# EAGLE schematic Spine14_v0 (EAGLE 6.4)

## Sheet 1 of 7
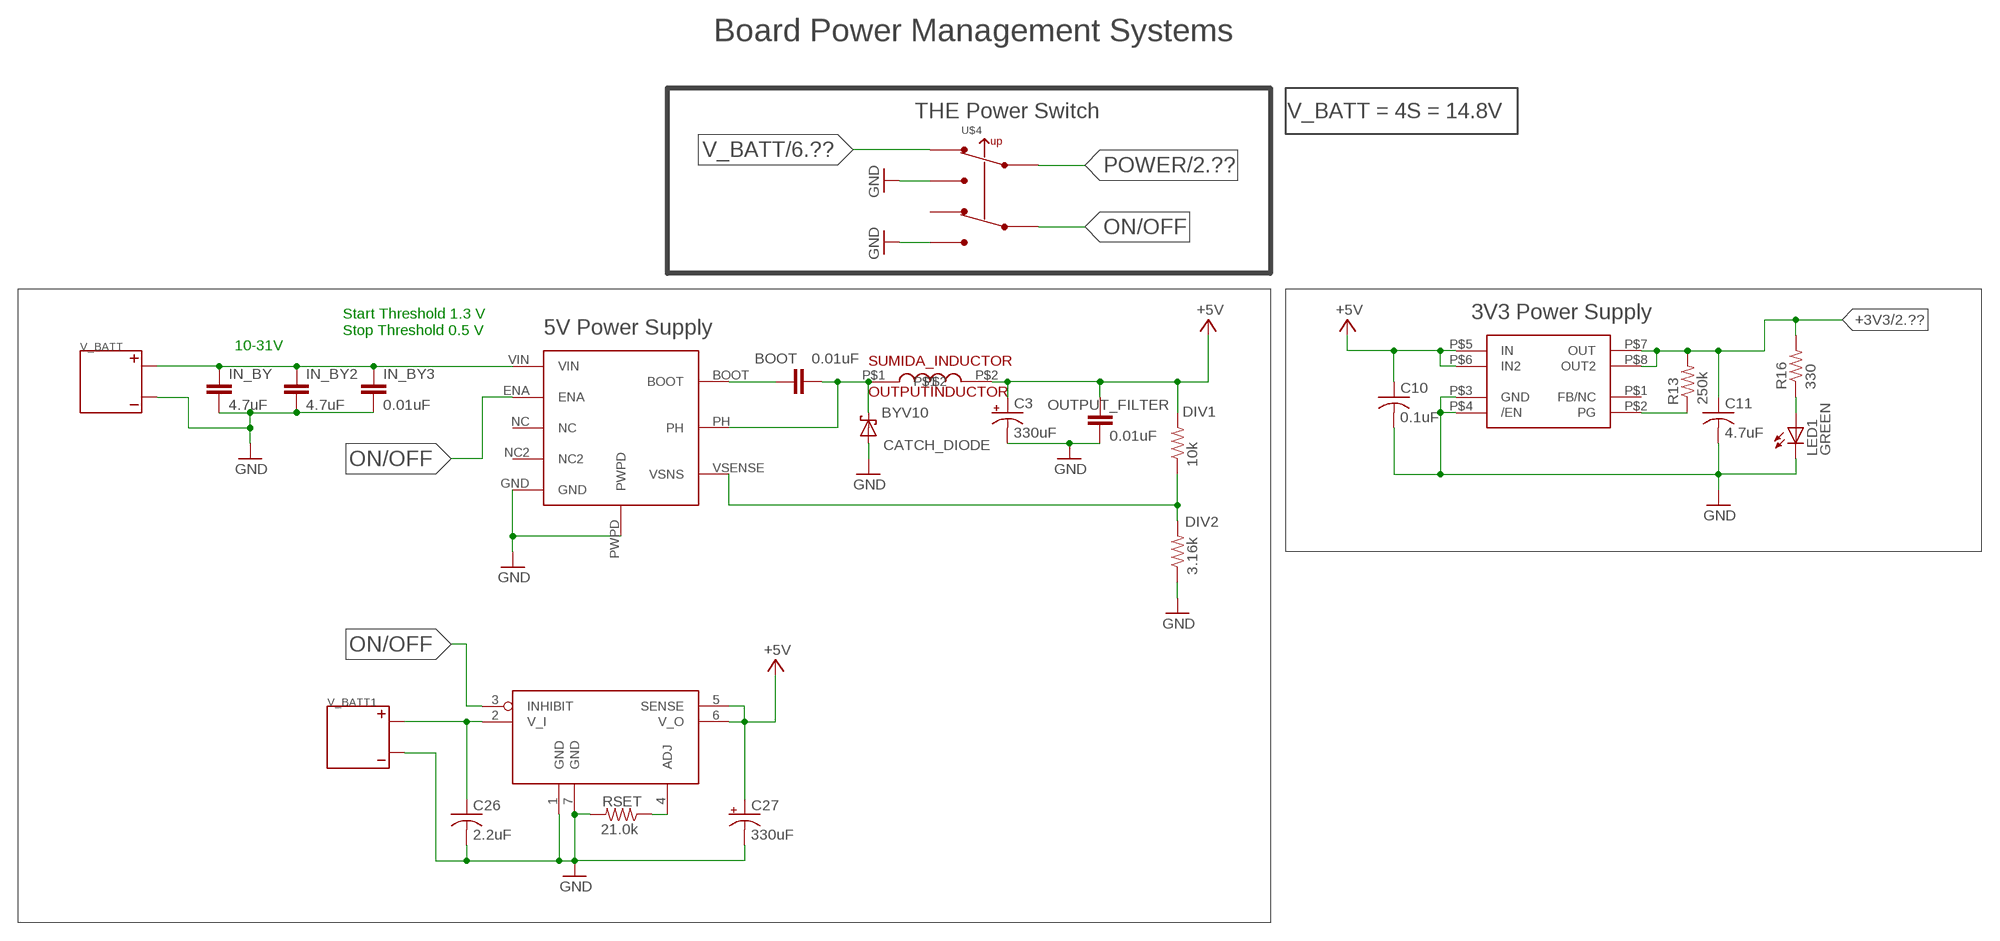
[diagram p0: schematic, sheet 1]

### Parts
BOOT  0.01uF  C-EUC0805  [C0805]
C3  330uF  CPOL-USF  [PANASONIC_F]
C10  0.1uF  C-USC0603  [C0603]
C11  4.7uF  C-USC0805  [C0805]
C26  2.2uF  C-USC0805  [C0805]
C27  330uF  CPOL-USF  [PANASONIC_F]
CATCH_DIODE  BYV10  [DO41-10]
DIV1  10k  R-US_R0805  [R0805]
DIV2  3.16k  R-US_R0805  [R0805]
IN_BY  4.7uF  C-EUC0805  [C0805]
IN_BY2  4.7uF  C-EUC0805  [C0805]
IN_BY3  0.01uF  C-EUC0805  [C0805]
LED1  GREEN  JON_LIB_LEDCHIPLED_0603  [JON_LIB_CHIPLED_0603]
OUTPUT_FILTER  0.01uF  C-EUC0805  [C0805]
OUTPUTINDUCTOR  SUMIDA_INDUCTOR  [SUMIDA_INDUCTOR]
R13  250k  R-US_R0603  [R0603]
R16  330  R-US_R0603  [R0603]
RSET  21.0k  R-US_R0805  [R0805]
U2  REG_3V_8SOIC  [8-SOIC]
U$1  TPS5450  [TPS5450-Q1]
U$4  JON_LIB_SWITCH_DPDT  [JON_LIB_SWITCH_VERT_DPDT]
U$5  POWER-MODULE-TI-6A_SOLDERLESS_TERMINAL  [POWER-MOD-TI-6A-SOLDERLESS-TERMINAL]
V_BATT  BATT-CONN-50A_MINI-FIT-SR_THRU-HOLE  [BATT-CONN-50A]
V_BATT1  BATT-CONN-50A_MINI-FIT-SR_THRU-HOLE  [BATT-CONN-50A]

### Nets
+3V3: C11.1 R13.2 R16.2 U2.P$7(OUT) U2.P$8(OUT2) ; also sheet 2,5
+5V: C3.+ C10.1 C27.+ DIV1.2 OUTPUT_FILTER.1 OUTPUTINDUCTOR.P$2 U2.P$5(IN) U2.P$6(IN2) U$5.5(SENSE) U$5.6(V_O) ; also sheet 4,5,6,7
GND: C3.- C10.2 C11.2 C26.2 C27.- CATCH_DIODE.A DIV2.1 IN_BY2.2 IN_BY3.2 IN_BY.2 LED1.C OUTPUT_FILTER.2 RSET.2 U2.P$3(GND) U2.P$4(/EN) U$1.GND U$1.PWPD U$4.P$1 U$4.P$4 U$5.1(GND) U$5.7(GND) V_BATT1.GND-1(GND) V_BATT1.GND-2(GND) V_BATT.GND-1(GND) V_BATT.GND-2(GND) ; also sheet 2,3,4,6,7
N$4: BOOT.1 U$1.BOOT
N$5: BOOT.2 CATCH_DIODE.C OUTPUTINDUCTOR.P$1 U$1.PH
N$6: DIV1.1 DIV2.2 U$1.VSENSE(VSNS)
N$8: LED1.A R16.1
N$10: R13.1 U2.P$2(PG)
N$18: RSET.1 U$5.4(ADJ)
N$20: C26.1 U$5.2(V_I) V_BATT1.VCC-1(VCC) V_BATT1.VCC-2(VCC)
ON/OFF: U$1.ENA U$4.P$2 U$5.3(INHIBIT)
POWER: U$4.P$5 ; also sheet 2,3,4
V_BATT: IN_BY2.1 IN_BY3.1 IN_BY.1 U$1.VIN U$4.P$6 V_BATT.VCC-1(VCC) V_BATT.VCC-2(VCC) ; also sheet 6
Unconnected: U2.P$1(FB/NC) U$1.NC U$1.NC2 U$4.P$3

### Notes on the sheet
- Board Power Management Systems
- V_BATT = 4S = 14.8V
- THE Power Switch
- 3V3 Power Supply
- Start Threshold 1.3 V
  Stop Threshold 0.5 V
- 5V Power Supply
- 10-31V

## Sheet 2 of 7
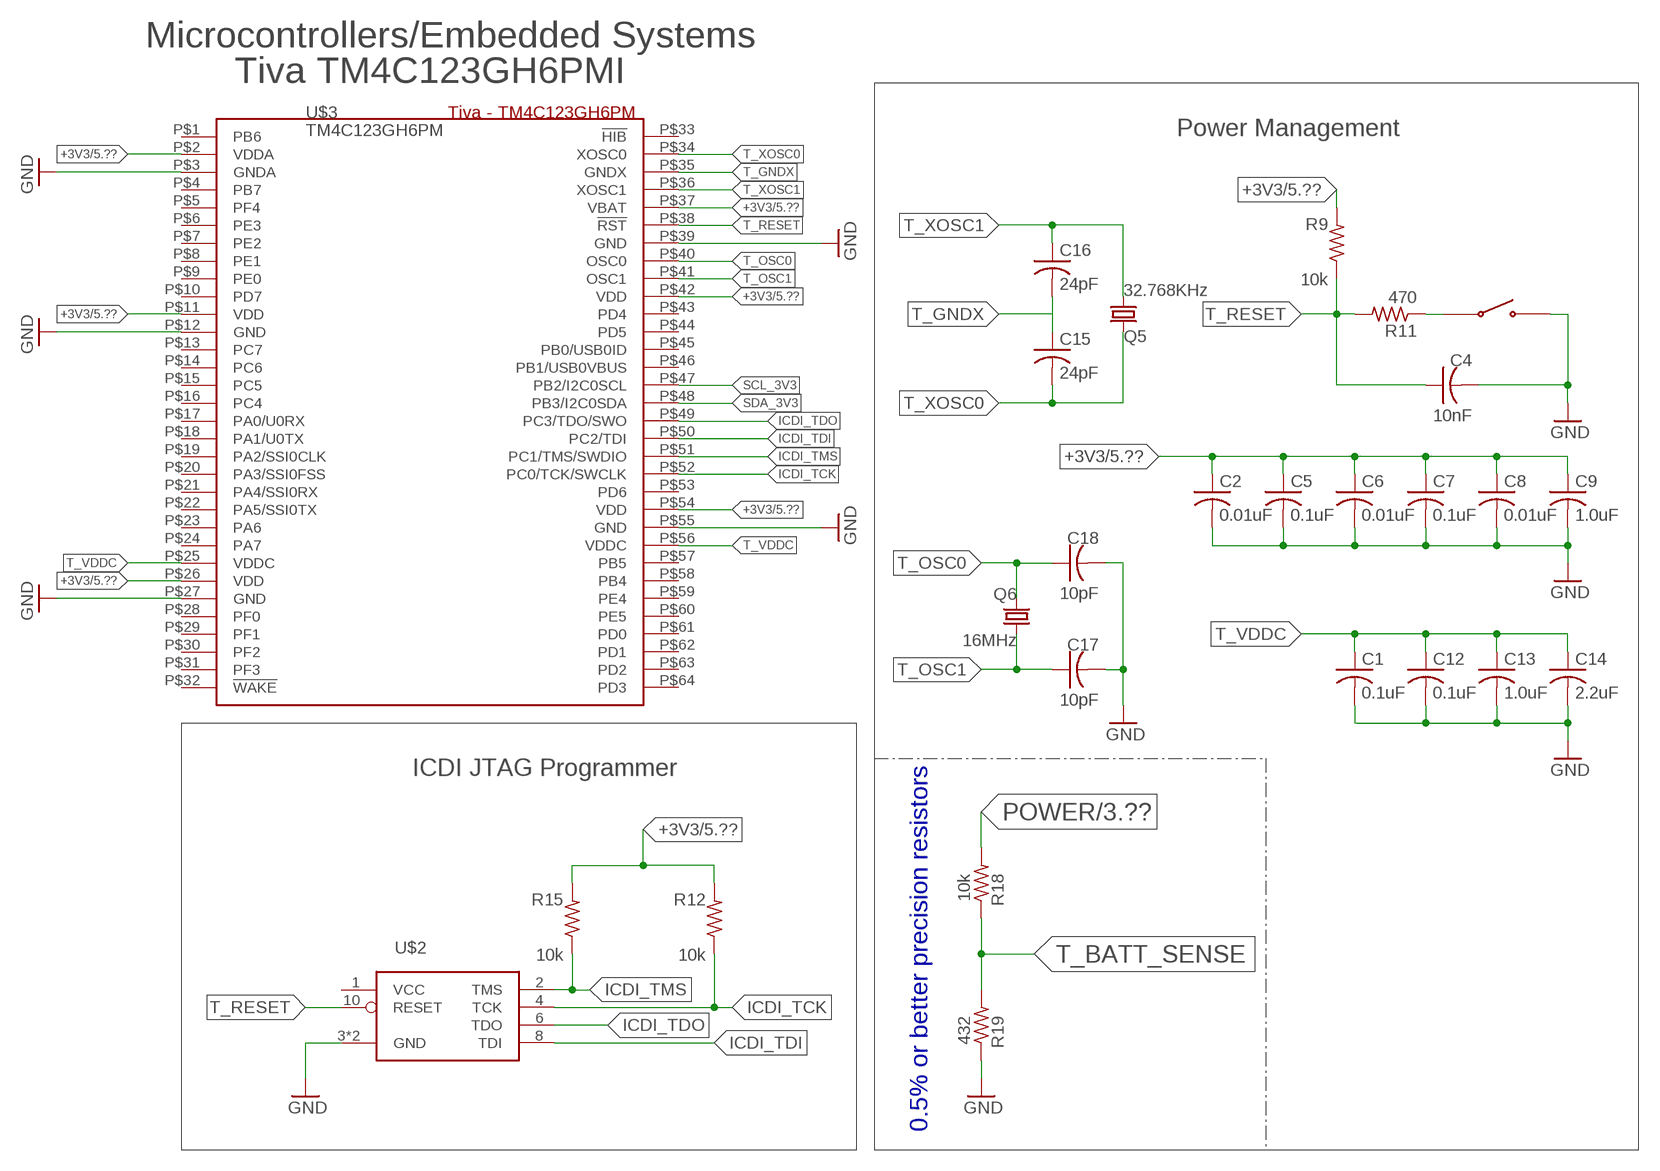
[diagram p1: schematic, sheet 2]

### Parts
C1  0.1uF  C-USC0603  [C0603]
C2  0.01uF  C-USC0603  [C0603]
C4  10nF  C-USC0603  [C0603]
C5  0.1uF  C-USC0603  [C0603]
C6  0.01uF  C-USC0603  [C0603]
C7  0.1uF  C-USC0603  [C0603]
C8  0.01uF  C-USC0603  [C0603]
C9  1.0uF  C-USC0603  [C0603]
C12  0.1uF  C-USC0603  [C0603]
C13  1.0uF  C-USC0603  [C0603]
C14  2.2uF  C-USC0603  [C0603]
C15  24pF  C-USC0603  [C0603]
C16  24pF  C-USC0603  [C0603]
C17  10pF  C-USC0603  [C0603]
C18  10pF  C-USC0603  [C0603]
Q5  32.768KHz  CRYSTALTC26H  [TC26H]
Q6  16MHz  CRYSTALHC49UP  [HC49UP]
R9  10k  R-US_R0603  [R0603]
R11  470  R-US_R0603  [R0603]
R12  10k  R-US_R0603  [R0603]
R15  10k  R-US_R0603  [R0603]
R18  10k  R-US_R0603  [R0603]
R19  432  R-US_R0603  [R0603]
S1  SWITCH-OFF-MOM_SMD_TACTILE  [SWITCH_TACT_NO_SPST_PAN]
U$2  JTAG-ARM_TC-10  [TC2050-IDC]
U$3  TM4C123GH6PM  [TM4C123GH6PM]

### Nets
+3V3: C2.1 C5.1 C6.1 C7.1 C8.1 C9.1 R9.2 R12.2 R15.2 U$3.P$2(VDDA) U$3.P$11(VDD) U$3.P$26(VDD) U$3.P$37(VBAT) U$3.P$42(VDD) U$3.P$54(VDD) ; also sheet 1,5
GND: C1.2 C2.2 C4.2 C5.2 C6.2 C7.2 C8.2 C9.2 C12.2 C13.2 C14.2 C17.2 C18.2 R19.1 S1.2 S1.4 U$2.3(GND) U$2.9(GND) U$3.P$3(GNDA) U$3.P$12(GND) U$3.P$27(GND) U$3.P$39(GND) U$3.P$55(GND) ; also sheet 1,3,4,6,7
ICDI_TCK: R12.1 U$2.4(TCK) U$3.P$52(PC0/TCK/SWCLK)
ICDI_TDI: U$2.8(TDI) U$3.P$50(PC2/TDI)
ICDI_TDO: U$2.6(TDO) U$3.P$49(PC3/TDO/SWO)
ICDI_TMS: R15.1 U$2.2(TMS) U$3.P$51(PC1/TMS/SWDIO)
N$7: C15.1 C16.2
N$12: R11.1 S1.1 S1.3
POWER: R18.2 ; also sheet 1,3,4
SCL_3V3: U$3.P$47(PB2/I2C0SCL) ; also sheet 5
SDA_3V3: U$3.P$48(PB3/I2C0SDA) ; also sheet 5
T_BATT_SENSE: R18.1 R19.2
T_GNDX: U$3.P$35(GNDX)
T_OSC0: C18.1 Q6.2 U$3.P$40(OSC0)
T_OSC1: C17.1 Q6.1 U$3.P$41(OSC1)
T_RESET: C4.1 R9.1 R11.2 U$2.10(RESET)
T_VDDC: C1.1 C12.1 C13.1 C14.1
T_XOSC0: C15.2 Q5.2 U$3.P$34(XOSC0)
T_XOSC1: C16.1 Q5.1 U$3.P$36(XOSC1)
Unconnected: U$2.1(VCC) U$3.P$1(PB6) U$3.P$4(PB7) U$3.P$5(PF4) U$3.P$6(PE3) U$3.P$7(PE2) U$3.P$8(PE1) U$3.P$9(PE0) U$3.P$10(PD7) U$3.P$13(PC7) U$3.P$14(PC6) U$3.P$15(PC5) U$3.P$16(PC4) U$3.P$17(PA0/U0RX) U$3.P$18(PA1/U0TX) U$3.P$19(PA2/SSI0CLK) U$3.P$20(PA3/SSI0FSS) U$3.P$21(PA4/SSI0RX) U$3.P$22(PA5/SSI0TX) U$3.P$23(PA6) U$3.P$24(PA7) U$3.P$25(VDDC) U$3.P$28(PF0) U$3.P$29(PF1) U$3.P$30(PF2) U$3.P$31(PF3) U$3.P$32(!WAKE) U$3.P$33(!HIB) U$3.P$38(!RST) U$3.P$43(PD4) U$3.P$44(PD5) U$3.P$45(PB0/USB0ID) U$3.P$46(PB1/USB0VBUS) U$3.P$53(PD6) U$3.P$56(VDDC) U$3.P$57(PB5) U$3.P$58(PB4) U$3.P$59(PE4) U$3.P$60(PE5) U$3.P$61(PD0) U$3.P$62(PD1) U$3.P$63(PD2) U$3.P$64(PD3)

### Notes on the sheet
- Microcontrollers/Embedded Systems
- Tiva TM4C123GH6PMI
- Power Management
- ICDI JTAG Programmer
- 0.5% or better precision resistors

## Sheet 3 of 7
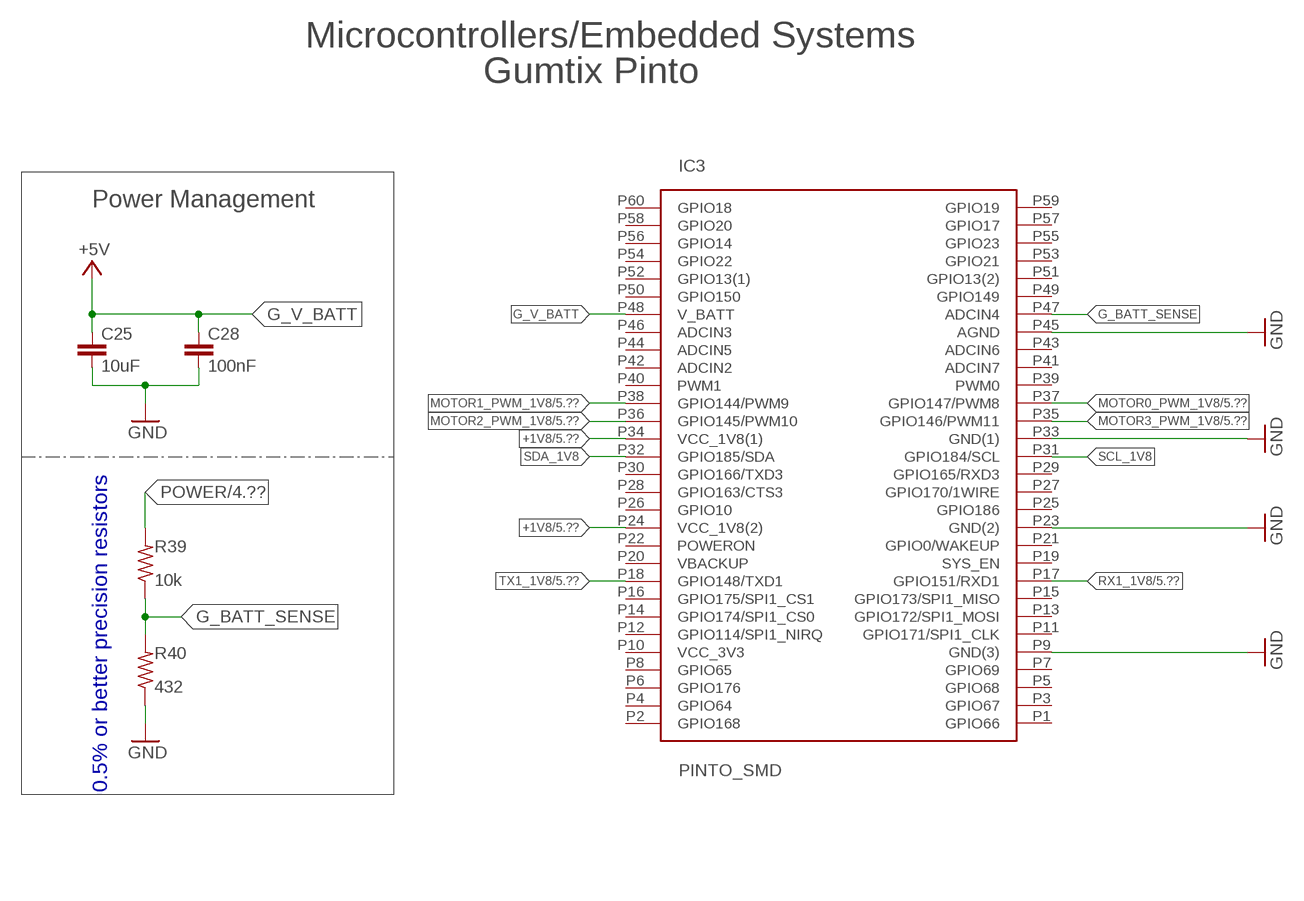
[diagram p2: schematic, sheet 3]

### Parts
C25  10uF  C-EUC1206  [C1206]
C28  100nF  C-EUC0603  [C0603]
IC3  PINTO_SMD  [PINTO_SMD]
R39  10k  R-USR0603  [R0603]
R40  432  R-USR0603  [R0603]

### Nets
+1V8: IC3.P24(VCC_1V8(2)) IC3.P34(VCC_1V8(1)) ; also sheet 5
G_BATT_SENSE: IC3.P47(ADCIN4) R39.1 R40.2
G_V_BATT: C25.1 C28.1 IC3.P48(V_BATT) ; supply symbol labelled +5V
GND: C25.2 C28.2 IC3.P9(GND(3)) IC3.P23(GND(2)) IC3.P33(GND(1)) IC3.P45(AGND) R40.1 ; also sheet 1,2,4,6,7
MOTOR0_PWM_1V8: IC3.P37(GPIO147/PWM8) ; also sheet 5
MOTOR1_PWM_1V8: IC3.P38(GPIO144/PWM9) ; also sheet 5
MOTOR2_PWM_1V8: IC3.P36(GPIO145/PWM10) ; also sheet 5
MOTOR3_PWM_1V8: IC3.P35(GPIO146/PWM11) ; also sheet 5
POWER: R39.2 ; also sheet 1,2,4
RX1_1V8: IC3.P17(GPIO151/RXD1) ; also sheet 5
SCL_1V8: IC3.P31(GPIO184/SCL) ; also sheet 5
SDA_1V8: IC3.P32(GPIO185/SDA) ; also sheet 5
TX1_1V8: IC3.P18(GPIO148/TXD1) ; also sheet 5
Unconnected: IC3.P1(GPIO66) IC3.P2(GPIO168) IC3.P3(GPIO67) IC3.P4(GPIO64) IC3.P5(GPIO68) IC3.P6(GPIO176) IC3.P7(GPIO69) IC3.P8(GPIO65) IC3.P10(VCC_3V3) IC3.P11(GPIO171/SPI1_CLK) IC3.P12(GPIO114/SPI1_NIRQ) IC3.P13(GPIO172/SPI1_MOSI) IC3.P14(GPIO174/SPI1_CS0) IC3.P15(GPIO173/SPI1_MISO) IC3.P16(GPIO175/SPI1_CS1) IC3.P19(SYS_EN) IC3.P20(VBACKUP) IC3.P21(GPIO0/WAKEUP) IC3.P22(POWERON) IC3.P25(GPIO186) IC3.P26(GPIO10) IC3.P27(GPIO170/1WIRE) IC3.P28(GPIO163/CTS3) IC3.P29(GPIO165/RXD3) IC3.P30(GPIO166/TXD3) IC3.P39(PWM0) IC3.P40(PWM1) IC3.P41(ADCIN7) IC3.P42(ADCIN2) IC3.P43(ADCIN6) IC3.P44(ADCIN5) IC3.P46(ADCIN3) IC3.P49(GPIO149) IC3.P50(GPIO150) IC3.P51(GPIO13(2)) IC3.P52(GPIO13(1)) IC3.P53(GPIO21) IC3.P54(GPIO22) IC3.P55(GPIO23) IC3.P56(GPIO14) IC3.P57(GPIO17) IC3.P58(GPIO20) IC3.P59(GPIO19) IC3.P60(GPIO18)

### Notes on the sheet
- Microcontrollers/Embedded Systems
- Gumtix Pinto
- Power Management
- 0.5% or better precision resistors

## Sheet 4 of 7
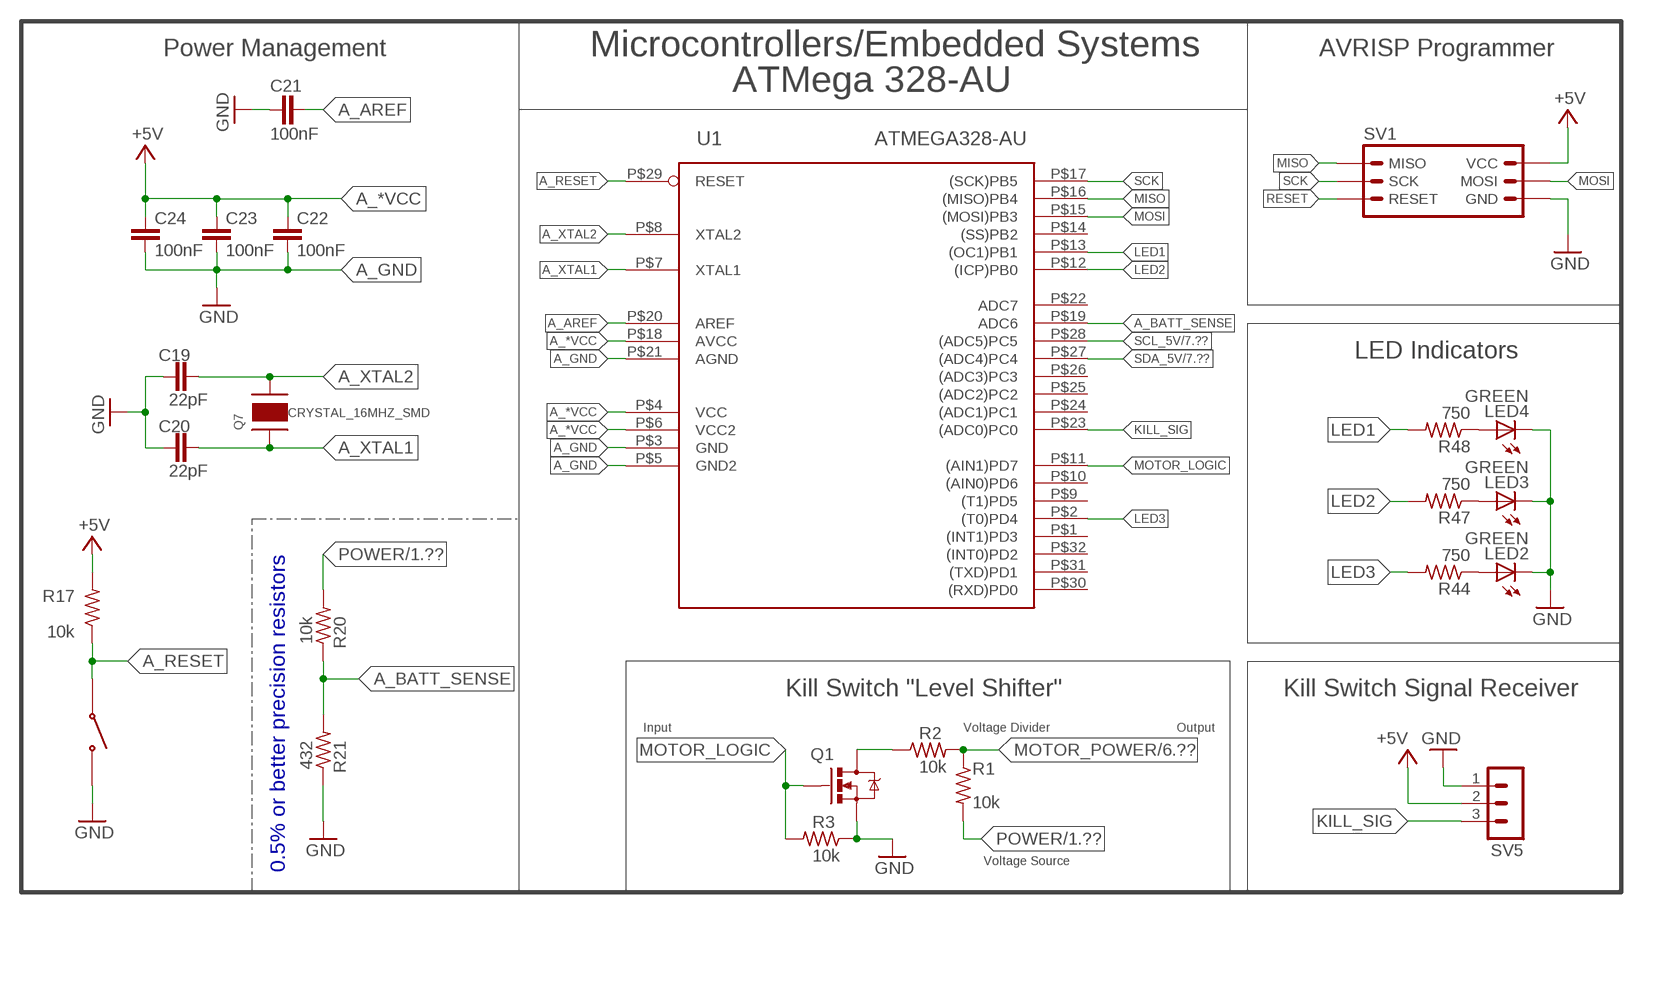
[diagram p3: schematic, sheet 4]

### Parts
C19  22pF  C-EUC0603  [C0603]
C20  22pF  C-EUC0603  [C0603]
C21  100nF  C-EUC0603  [C0603]
C22  100nF  C-EUC0603  [C0603]
C23  100nF  C-EUC0603  [C0603]
C24  100nF  C-EUC0603  [C0603]
LED2  GREEN  LEDCHIPLED_0603  [CHIPLED_0603]
LED3  GREEN  LEDCHIPLED_0603  [CHIPLED_0603]
LED4  GREEN  LEDCHIPLED_0603  [CHIPLED_0603]
Q1  MOSFET-NCHANNELBSS138  [SOT23]
Q7  CRYSTAL_16MHZ_SMD  [4-SMD_DFN]
R1  10k  R-US_R0603  [R0603]
R2  10k  R-US_R0603  [R0603]
R3  10k  R-US_R0603  [R0603]
R17  10k  R-USR0603  [R0603]
R20  10k  R-US_R0603  [R0603]
R21  432  R-US_R0603  [R0603]
R44  750  R-USR0805  [R0805]
R47  750  R-USR0805  [R0805]
R48  750  R-USR0805  [R0805]
S2  SWITCH-OFF-MOM_SMD_TACTILE  [SWITCH_TACT_NO_SPST_PAN]
SV1  AVRISP-6_3X2_PLUG_OF_NAILS  [TC2030-IDC]
SV5  MA03-1  [MA03-1]
U1  ATMEGA328-AU  [32-TQFP]

### Nets
+5V: R17.2 SV1.6(VCC) SV5.2 ; also sheet 1,5,6,7
A_*VCC: C22.1 C23.1 C24.1 U1.P$4(VCC) U1.P$6(VCC2) U1.P$18(AVCC) ; supply symbol labelled +5V
A_AREF: C21.1 U1.P$20(AREF)
A_BATT_SENSE: R20.1 R21.2 U1.P$19(ADC6)
A_GND: C22.2 C23.2 C24.2 U1.P$3(GND) U1.P$5(GND2) U1.P$21(AGND) ; supply symbol labelled GND
A_RESET: R17.1 S2.1 S2.3 U1.P$29(RESET)
A_XTAL1: C20.2 Q7.X1 U1.P$7(XTAL1)
A_XTAL2: C19.2 Q7.X2 U1.P$8(XTAL2)
GND: C19.1 C20.1 C21.2 LED2.C LED3.C LED4.C Q1.2(S) R3.1 R21.1 S2.2 S2.4 SV1.4(GND) SV5.1 ; also sheet 1,2,3,6,7
KILL_SIG: SV5.3 U1.P$23((ADC0)PC0)
LED1: R48.2 U1.P$13((OC1)PB1)
LED2: R47.2 U1.P$12((ICP)PB0)
LED3: R44.2 U1.P$2((T0)PD4)
MISO: SV1.1(MISO) U1.P$16((MISO)PB4)
MOSI: SV1.5(MOSI) U1.P$15((MOSI)PB3)
MOTOR_LOGIC: Q1.1(G) R3.2 U1.P$11((AIN1)PD7)
MOTOR_POWER: R1.1 R2.2 ; also sheet 6
N$1: Q1.3(D) R2.1
N$9: LED2.A R44.1
N$33: LED3.A R47.1
N$34: LED4.A R48.1
POWER: R1.2 R20.2 ; also sheet 1,2,3
RESET: SV1.3(RESET)
SCK: SV1.2(SCK) U1.P$17((SCK)PB5)
SCL_5V: U1.P$28((ADC5)PC5) ; also sheet 5,7
SDA_5V: U1.P$27((ADC4)PC4) ; also sheet 5,7
Unconnected: U1.P$1((INT1)PD3) U1.P$9((T1)PD5) U1.P$10((AIN0)PD6) U1.P$14((SS)PB2) U1.P$22(ADC7) U1.P$24((ADC1)PC1) U1.P$25((ADC2)PC2) U1.P$26((ADC3)PC3) U1.P$30((RXD)PD0) U1.P$31((TXD)PD1) U1.P$32((INT0)PD2)

### Notes on the sheet
- Power Management | Microcontrollers/Embedded Systems | AVRISP Programmer
- ATMega 328-AU
- LED Indicators
- 0.5% or better precision resistors
- Kill Switch "Level Shifter" | Kill Switch Signal Receiver
- Input | Voltage Divider | Output
- Voltage Source

## Sheet 5 of 7
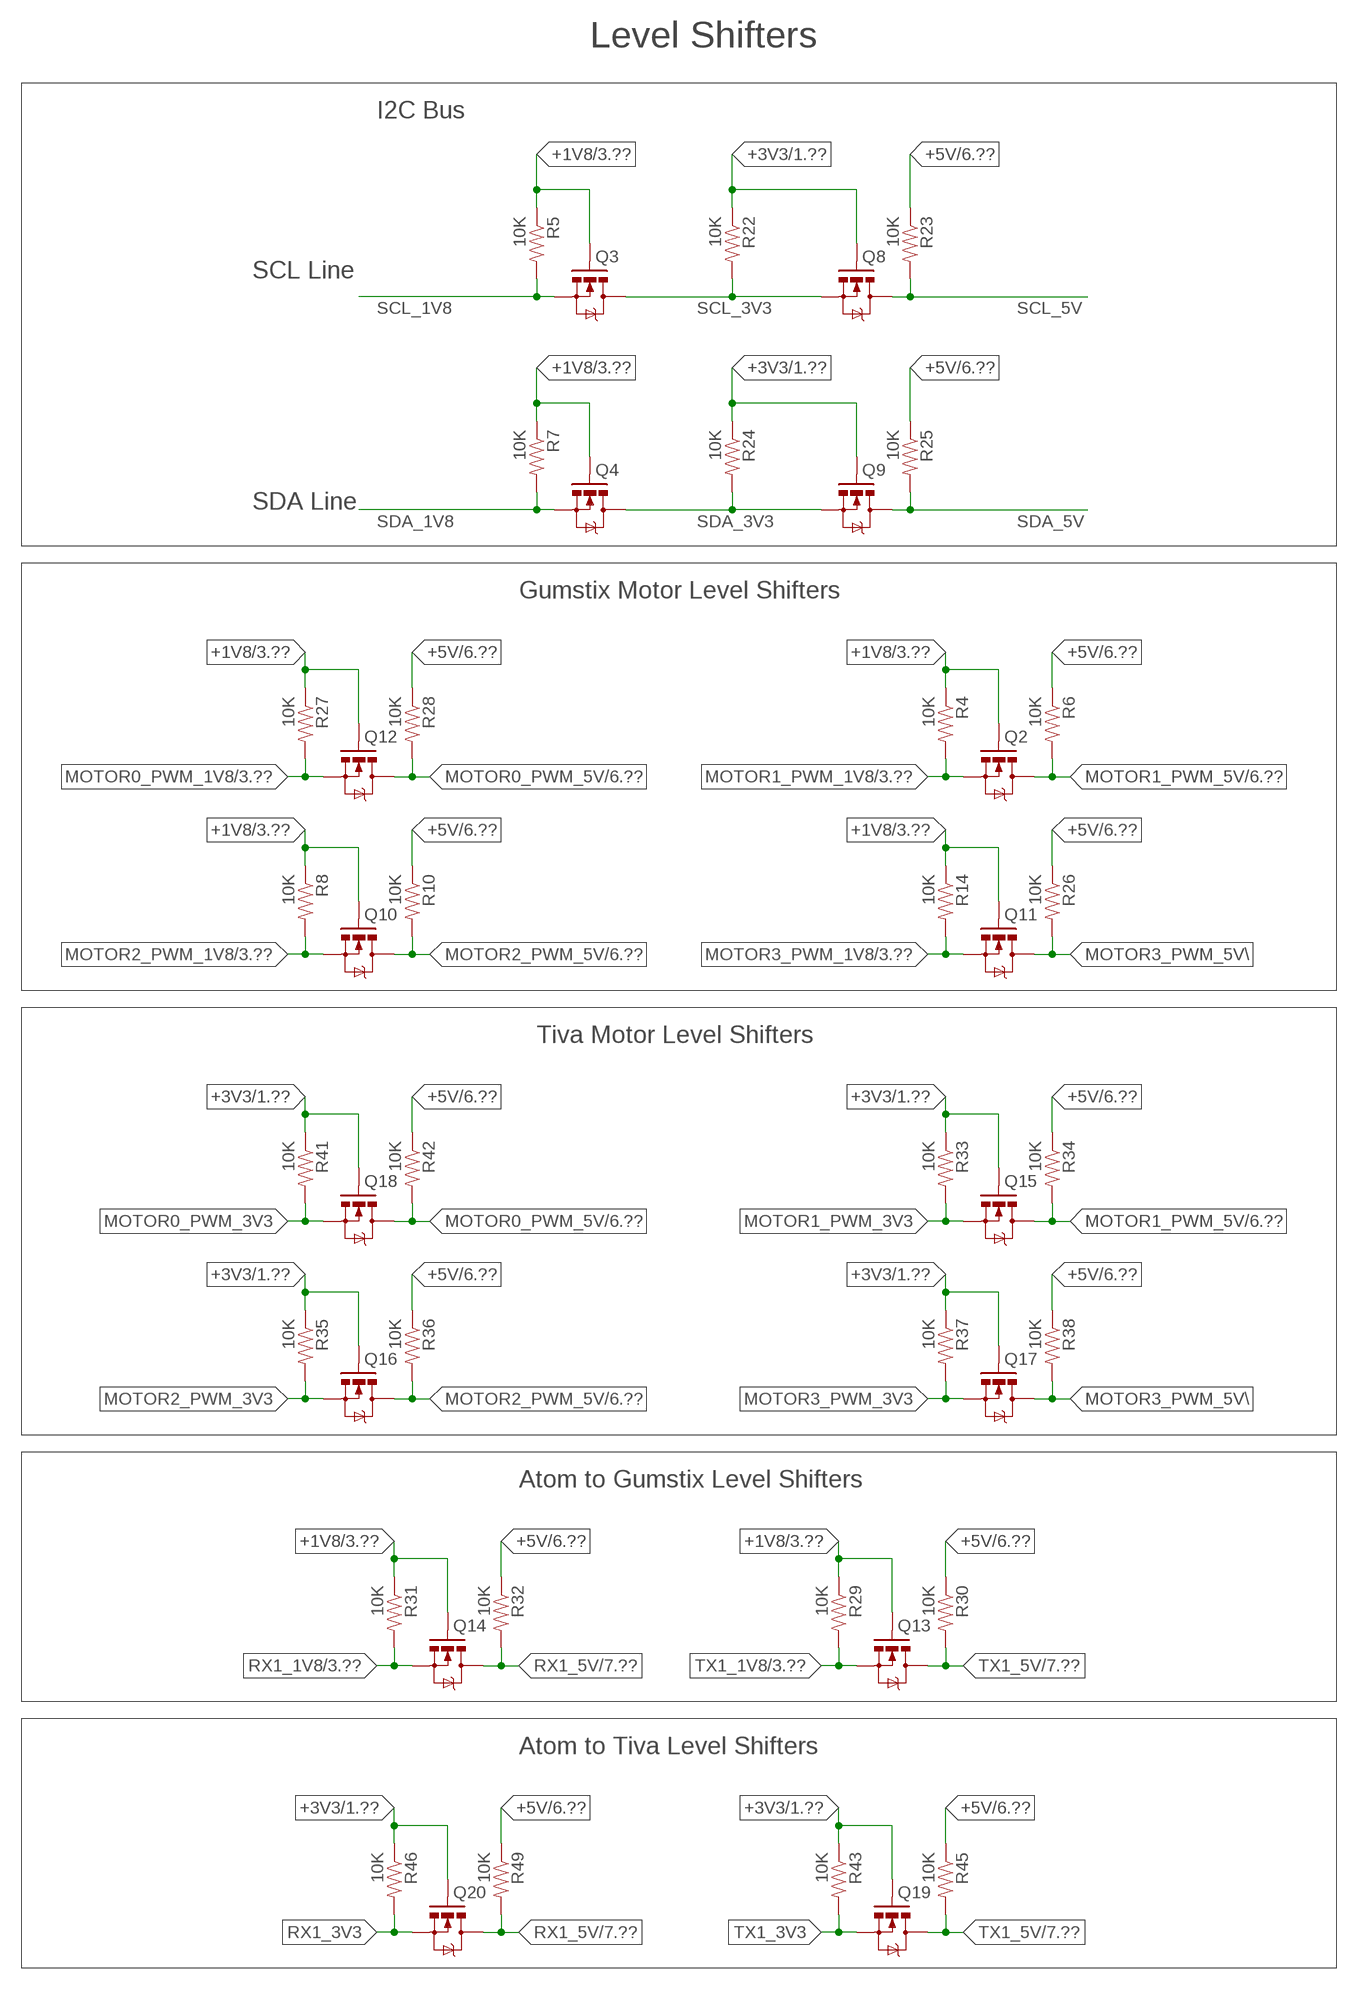
[diagram p4: schematic, sheet 5]

### Parts
Q2  BSS138  MOSFET-NCHANNELBSS138  [SOT23]
Q3  MOSFET-NCHANNELBSS138  [SOT23]
Q4  MOSFET-NCHANNELBSS138  [SOT23]
Q8  MOSFET-NCHANNELBSS138  [SOT23]
Q9  MOSFET-NCHANNELBSS138  [SOT23]
Q10  BSS138  MOSFET-NCHANNELBSS138  [SOT23]
Q11  BSS138  MOSFET-NCHANNELBSS138  [SOT23]
Q12  BSS138  MOSFET-NCHANNELBSS138  [SOT23]
Q13  BSS138  MOSFET-NCHANNELBSS138  [SOT23]
Q14  BSS138  MOSFET-NCHANNELBSS138  [SOT23]
Q15  BSS138  MOSFET-NCHANNELBSS138  [SOT23]
Q16  BSS138  MOSFET-NCHANNELBSS138  [SOT23]
Q17  BSS138  MOSFET-NCHANNELBSS138  [SOT23]
Q18  BSS138  MOSFET-NCHANNELBSS138  [SOT23]
Q19  BSS138  MOSFET-NCHANNELBSS138  [SOT23]
Q20  BSS138  MOSFET-NCHANNELBSS138  [SOT23]
R4  10K  RESISTOR0603-RES  [0603-RES]
R5  10K  RESISTOR0603-RES  [0603-RES]
R6  10K  RESISTOR0603-RES  [0603-RES]
R7  10K  RESISTOR0603-RES  [0603-RES]
R8  10K  RESISTOR0603-RES  [0603-RES]
R10  10K  RESISTOR0603-RES  [0603-RES]
R14  10K  RESISTOR0603-RES  [0603-RES]
R22  10K  RESISTOR0603-RES  [0603-RES]
R23  10K  RESISTOR0603-RES  [0603-RES]
R24  10K  RESISTOR0603-RES  [0603-RES]
R25  10K  RESISTOR0603-RES  [0603-RES]
R26  10K  RESISTOR0603-RES  [0603-RES]
R27  10K  RESISTOR0603-RES  [0603-RES]
R28  10K  RESISTOR0603-RES  [0603-RES]
R29  10K  RESISTOR0603-RES  [0603-RES]
R30  10K  RESISTOR0603-RES  [0603-RES]
R31  10K  RESISTOR0603-RES  [0603-RES]
R32  10K  RESISTOR0603-RES  [0603-RES]
R33  10K  RESISTOR0603-RES  [0603-RES]
R34  10K  RESISTOR0603-RES  [0603-RES]
R35  10K  RESISTOR0603-RES  [0603-RES]
R36  10K  RESISTOR0603-RES  [0603-RES]
R37  10K  RESISTOR0603-RES  [0603-RES]
R38  10K  RESISTOR0603-RES  [0603-RES]
R41  10K  RESISTOR0603-RES  [0603-RES]
R42  10K  RESISTOR0603-RES  [0603-RES]
R43  10K  RESISTOR0603-RES  [0603-RES]
R45  10K  RESISTOR0603-RES  [0603-RES]
R46  10K  RESISTOR0603-RES  [0603-RES]
R49  10K  RESISTOR0603-RES  [0603-RES]

### Nets
+1V8: Q2.1(G) Q3.1(G) Q4.1(G) Q10.1(G) Q11.1(G) Q12.1(G) Q13.1(G) Q14.1(G) R4.1 R5.1 R7.1 R8.1 R14.1 R27.1 R29.1 R31.1 ; also sheet 3
+3V3: Q8.1(G) Q9.1(G) Q15.1(G) Q16.1(G) Q17.1(G) Q18.1(G) Q19.1(G) Q20.1(G) R22.1 R24.1 R33.1 R35.1 R37.1 R41.1 R43.1 R46.1 ; also sheet 1,2
+5V: R6.1 R10.1 R23.1 R25.1 R26.1 R28.1 R30.1 R32.1 R34.1 R36.1 R38.1 R42.1 R45.1 R49.1 ; also sheet 1,4,6,7
MOTOR0_PWM_1V8: Q12.2(S) R27.2 ; also sheet 3
MOTOR0_PWM_3V3: Q18.2(S) R41.2
MOTOR0_PWM_5V: Q12.3(D) Q18.3(D) R28.2 R42.2 ; also sheet 6
MOTOR1_PWM_1V8: Q2.2(S) R4.2 ; also sheet 3
MOTOR1_PWM_3V3: Q15.2(S) R33.2
MOTOR1_PWM_5V: Q2.3(D) Q15.3(D) R6.2 R34.2 ; also sheet 6
MOTOR2_PWM_1V8: Q10.2(S) R8.2 ; also sheet 3
MOTOR2_PWM_3V3: Q16.2(S) R35.2
MOTOR2_PWM_5V: Q10.3(D) Q16.3(D) R10.2 R36.2 ; also sheet 6
MOTOR3_PWM_1V8: Q11.2(S) R14.2 ; also sheet 3
MOTOR3_PWM_3V3: Q17.2(S) R37.2
MOTOR3_PWM_5V\: Q11.3(D) Q17.3(D) R26.2 R38.2
RX1_1V8: Q14.2(S) R31.2 ; also sheet 3
RX1_3V3: Q20.2(S) R46.2
RX1_5V: Q14.3(D) Q20.3(D) R32.2 R49.2 ; also sheet 7
SCL_1V8: Q3.2(S) R5.2 ; also sheet 3
SCL_3V3: Q3.3(D) Q8.2(S) R22.2 ; also sheet 2
SCL_5V: Q8.3(D) R23.2 ; also sheet 4,7
SDA_1V8: Q4.2(S) R7.2 ; also sheet 3
SDA_3V3: Q4.3(D) Q9.2(S) R24.2 ; also sheet 2
SDA_5V: Q9.3(D) R25.2 ; also sheet 4,7
TX1_1V8: Q13.2(S) R29.2 ; also sheet 3
TX1_3V3: Q19.2(S) R43.2
TX1_5V: Q13.3(D) Q19.3(D) R30.2 R45.2 ; also sheet 7

### Notes on the sheet
- Level Shifters
- I2C Bus
- SCL Line
- SDA Line
- Gumstix Motor Level Shifters
- Tiva Motor Level Shifters
- Atom to Gumstix Level Shifters
- Atom to Tiva Level Shifters

## Sheet 6 of 7
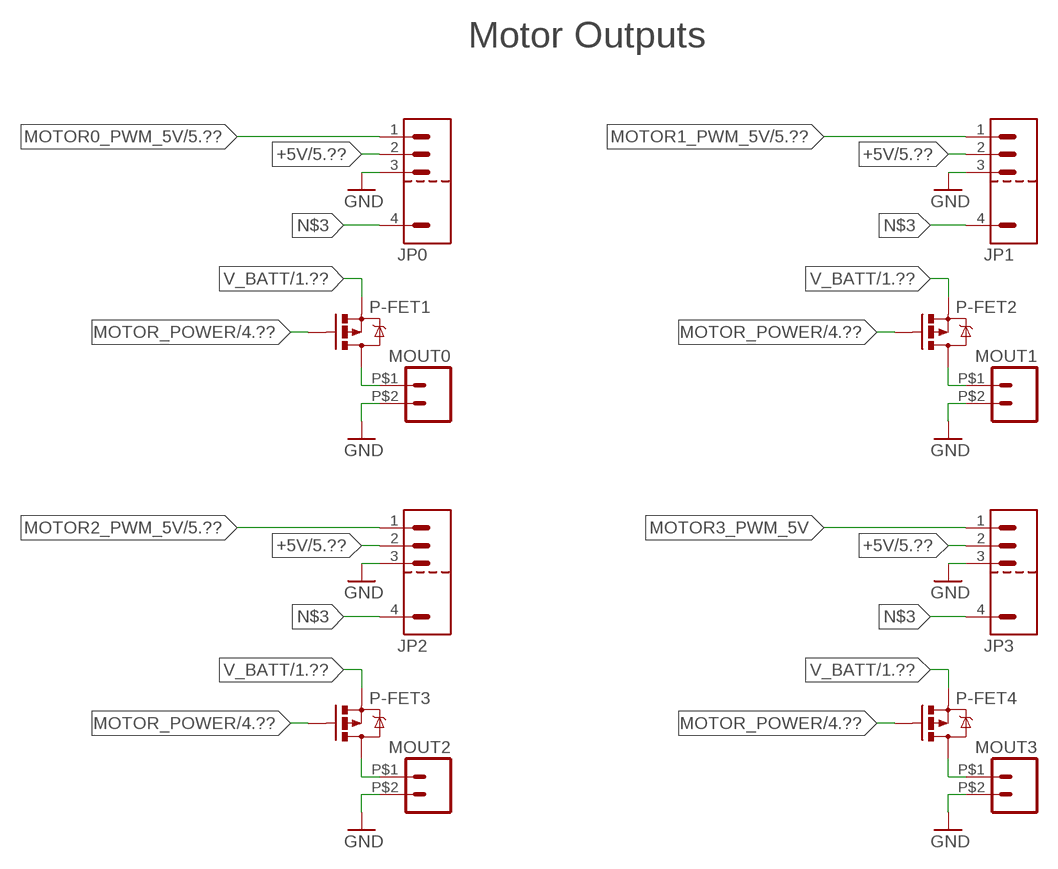
[diagram p5: schematic, sheet 6]

### Parts
JP0  EDGE_LITE_CONN_HEADER_3X2_THRU_HOLE  [PIN_HEADER_6POS_2ROW_THRU]
JP1  EDGE_LITE_CONN_HEADER_3X2_THRU_HOLE  [PIN_HEADER_6POS_2ROW_THRU]
JP2  EDGE_LITE_CONN_HEADER_3X2_THRU_HOLE  [PIN_HEADER_6POS_2ROW_THRU]
JP3  EDGE_LITE_CONN_HEADER_3X2_THRU_HOLE  [PIN_HEADER_6POS_2ROW_THRU]
MOUT0  MINI_FIT_JR_5569  [MINI_FIT_JR]
MOUT1  MINI_FIT_JR_5569  [MINI_FIT_JR]
MOUT2  MINI_FIT_JR_5569  [MINI_FIT_JR]
MOUT3  MINI_FIT_JR_5569  [MINI_FIT_JR]
P-FET1  MOSFET_P-CHANNEL  [POWERPAK_SO-8_SINGLE]
P-FET2  MOSFET_P-CHANNEL  [POWERPAK_SO-8_SINGLE]
P-FET3  MOSFET_P-CHANNEL  [POWERPAK_SO-8_SINGLE]
P-FET4  MOSFET_P-CHANNEL  [POWERPAK_SO-8_SINGLE]

### Nets
+5V: JP0.2 JP1.2 JP2.2 JP3.2 ; also sheet 1,4,5,7
GND: JP0.3 JP1.3 JP2.3 JP3.3 MOUT0.P$2 MOUT1.P$2 MOUT2.P$2 MOUT3.P$2 ; also sheet 1,2,3,4,7
MOTOR0_PWM_5V: JP0.1 ; also sheet 5
MOTOR1_PWM_5V: JP1.1 ; also sheet 5
MOTOR2_PWM_5V: JP2.1 ; also sheet 5
MOTOR3_PWM_5V: JP3.1
MOTOR_POWER: P-FET1.P$4(G) P-FET2.P$4(G) P-FET3.P$4(G) P-FET4.P$4(G) ; also sheet 4
N$2: MOUT0.P$1 P-FET1.P$5(D) P-FET1.P$6(D) P-FET1.P$7(D) P-FET1.P$8(D)
N$3: JP0.4 JP1.4 JP2.4 JP3.4
N$15: MOUT1.P$1 P-FET2.P$5(D) P-FET2.P$6(D) P-FET2.P$7(D) P-FET2.P$8(D)
N$16: MOUT2.P$1 P-FET3.P$5(D) P-FET3.P$6(D) P-FET3.P$7(D) P-FET3.P$8(D)
N$17: MOUT3.P$1 P-FET4.P$5(D) P-FET4.P$6(D) P-FET4.P$7(D) P-FET4.P$8(D)
V_BATT: P-FET1.P$1(S) P-FET1.P$2(S) P-FET1.P$3(S) P-FET2.P$1(S) P-FET2.P$2(S) P-FET2.P$3(S) P-FET3.P$1(S) P-FET3.P$2(S) P-FET3.P$3(S) P-FET4.P$1(S) P-FET4.P$2(S) P-FET4.P$3(S) ; also sheet 1

### Notes on the sheet
- Motor Outputs

## Sheet 7 of 7
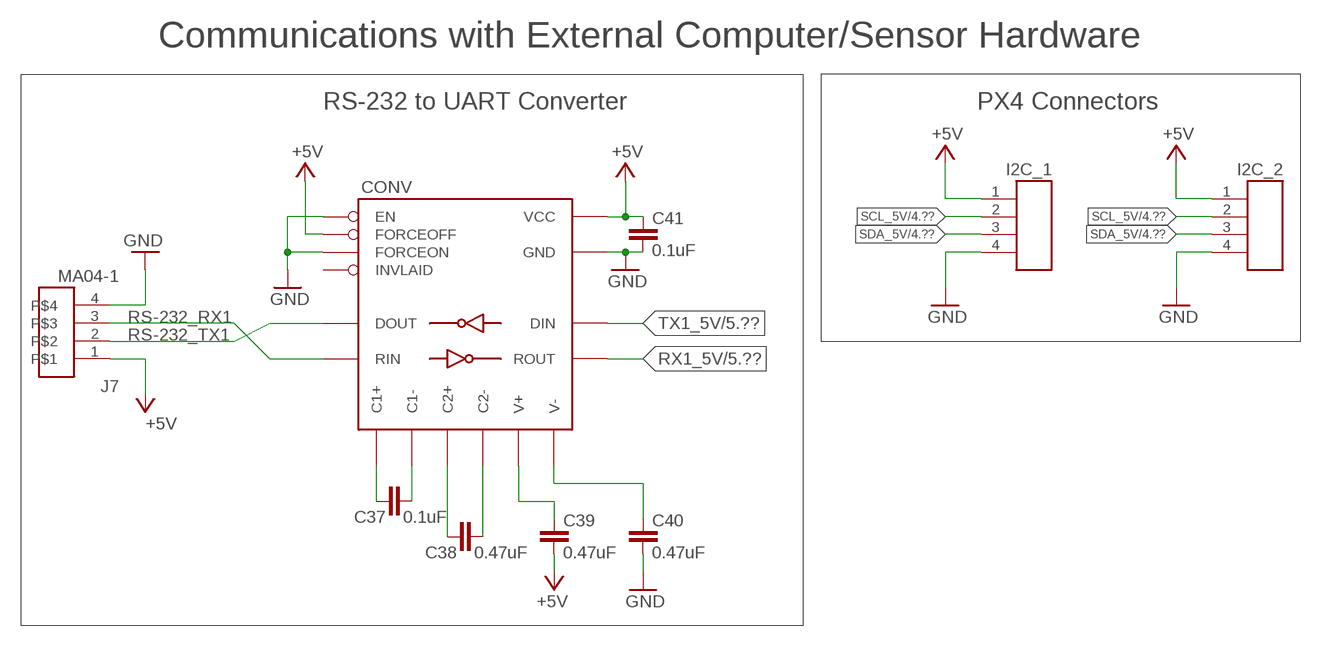
[diagram p6: schematic, sheet 7]

### Parts
C37  0.1uF  C-EUC0603  [C0603]
C38  0.47uF  C-EUC0805  [C0805]
C39  0.47uF  C-EUC0805  [C0805]
C40  0.47uF  C-EUC0805  [C0805]
C41  0.1uF  C-EUC0603  [C0603]
CONV  MAX3221-RS232  [16-TSSOP]
I2C_1  CONN_HEADER_4POS_RIGHT_ANGLE_I2C  [CONN_HEADER_4POS_1.25MM_SMD]
I2C_2  CONN_HEADER_4POS_RIGHT_ANGLE_I2C  [CONN_HEADER_4POS_1.25MM_SMD]
J7  MA04-1  [MA-04-SMD]

### Nets
+5V: C39.2 C41.1 CONV.P$15(VCC) CONV.P$16(FORCEOFF) I2C_1.1 I2C_2.1 J7.1 ; also sheet 1,4,5,6
GND: C40.2 C41.2 CONV.P$1(EN) CONV.P$12(FORCEON) CONV.P$14(GND) I2C_1.4 I2C_2.4 J7.4 ; also sheet 1,2,3,4,6
N$11: C37.1 CONV.P$2(C1+)
N$13: C39.1 CONV.P$3(V+)
N$14: C40.1 CONV.P$7(V-)
N$32: C37.2 CONV.P$4(C1-)
N$35: C38.1 CONV.P$5(C2+)
N$36: C38.2 CONV.P$6(C2-)
RS-232_RX1: CONV.P$8(RIN) J7.3
RS-232_TX1: CONV.P$13(DOUT) J7.2
RX1_5V: CONV.P$9(ROUT) ; also sheet 5
SCL_5V: I2C_1.2 I2C_2.2 ; also sheet 4,5
SDA_5V: I2C_1.3 I2C_2.3 ; also sheet 4,5
TX1_5V: CONV.P$11(DIN) ; also sheet 5
Unconnected: CONV.P$10(INVLAID)

### Notes on the sheet
- Communications with External Computer/Sensor Hardware
- PX4 Connectors
- RS-232 to UART Converter

## Library data of the parts
BOOT IN_BY IN_BY2 IN_BY3 OUTPUT_FILTER = rcl:C-EU: CAPACITOR, European symbol
C1 C2 C4-C18 C26 = rcl:C-US: CAPACITOR, American symbol
C3 C27 = rcl:CPOL-US: POLARIZED CAPACITOR, American symbol; DIGIKEY: PCE3779CT-ND
C19 C20 = Jon_LIB:C-EU: CAPACITOR, European symbol; DIGIKEY#: 478-6200-1-ND
C21-C24 C28 = Jon_LIB:C-EU: CAPACITOR, European symbol; DIGIKEY#: 1276-1000-1-ND
C25 = Jon_LIB:C-EU: CAPACITOR, European symbol; DIGIKEY#: 587-2399-1-ND
C37 C41 = Jon_LIB:C-EU: CAPACITOR, European symbol; DIGIKEY#: 490-1524-1-ND
C38-C40 = Jon_LIB:C-EU: CAPACITOR, European symbol; DIGIKEY#: 1276-2966-1-ND
CATCH_DIODE = diode:BYV10: DIODE power diode; DIGIKEY: SJPZ-N40VLCT-ND
CONV = Jon_LIB:MAX3221-RS232; DIGIKEY#: 296-19825-1-ND
DIV1 DIV2 R1-R3 R9 R11-R13 R15 R16 R18-R21 RSET = rcl:R-US_: RESISTOR, American symbol
I2C_1 I2C_2 = MAAV:CONN_HEADER_4POS
IC3 = Jon_LIB:PINTO_SMD; DIGIKEY#: S5641-ND (6)
J7 = Jon_LIB:MA04-1; DIGIKEY#: 455-1751-1-ND
JP0 JP1-JP3 = MAAV:EDGE_LITE_CONN_HEADER; DIGIKEY: 952-2092-ND
LED1 = MAAV_13v1:JON_LIB_LED: LED OSRAM: - CHIPLED LG R971, LG N971, LY N971, LG Q971, LY Q971, LO R971, LY R971 LH N974, LH R974 LS Q976, LO Q976, LY Q976 LO Q996 - Hyper CHIPLED LW Q18S LB Q993, LB Q99A, LB R99A - SideLED LS A670, LO A670, LY A670, LG A670, LP A670 LB A673, LV A673, LT A673, LW A673 LH A674 LY A675 LS A676, LA A676, LO A676, LY A676, LW A676 LS A679, LY A679, LG A679 - Hyper Micro SIDELED® LS Y876, LA Y876, LO Y876, LY Y876 LT Y87S - SmartLED LW L88C, LW L88S LB L89C, LB L89S, LG L890 LS L89K, LO L89K, LY L89K LS L896, LA L896, LO L896, LY L896 - TOPLED LS T670, LO T670, LY T670, LG T670, LP T670 LSG T670, LSP T670, LSY T670, LOP T670, LYG T670 LG T671, LOG T671, LSG T671 LB T673, LV T673, LT T673, LW T673 LH T674 LS T676, LA T676, LO T676, LY T676, LB T676, LH T676, LSB T676, LW T676 LB T67C, LV T67C, LT T67C, LS T67K, LO T67K, LY T67K, LW E67C LS E67B, LA E67B, LO E67B, LY E67B, LB E67C, LV E67C, LT E67C LW T67C LS T679, LY T679, LG T679 LS T770, LO T770, LY T770, LG T770, LP T770 LB T773, LV T773, LT T773, LW T773 LH T774 LS E675, LA E675, LY E675, LS T675 LS T776, LA T776, LO T776, LY T776, LB T776 LHGB T686 LT T68C, LB T68C - Hyper Mini TOPLED® LB M676 - Mini TOPLED Santana® LG M470 LS M47K, LO M47K, LY M47K Source: http://www.osram.convergy.de LUXEON: - LUMILED® LXK2-PW12-R00, LXK2-PW12-S00, LXK2-PW14-U00, LXK2-PW14-V00 LXK2-PM12-R00, LXK2-PM12-S00, LXK2-PM14-U00 LXK2-PE12-Q00, LXK2-PE12-R00, LXK2-PE12-S00, LXK2-PE14-T00, LXK2-PE14-U00 LXK2-PB12-K00, LXK2-PB12-L00, LXK2-PB12-M00, LXK2-PB14-N00, LXK2-PB14-P00, LXK2-PB14-Q00 LXK2-PR12-L00, LXK2-PR12-M00, LXK2-PR14-Q00, LXK2-PR14-R00 LXK2-PD12-Q00, LXK2-PD12-R00, LXK2-PD12-S00 LXK2-PH12-R00, LXK2-PH12-S00 LXK2-PL12-P00, LXK2-PL12-Q00, LXK2-PL12-R00 Source: www.luxeon.com KINGBRIGHT: KA-3528ASYC Source: www.kingbright.com
LED2-LED4 = Jon_LIB:LED: LED OSRAM: - CHIPLED LG R971, LG N971, LY N971, LG Q971, LY Q971, LO R971, LY R971 LH N974, LH R974 LS Q976, LO Q976, LY Q976 LO Q996 - Hyper CHIPLED LW Q18S LB Q993, LB Q99A, LB R99A - SideLED LS A670, LO A670, LY A670, LG A670, LP A670 LB A673, LV A673, LT A673, LW A673 LH A674 LY A675 LS A676, LA A676, LO A676, LY A676, LW A676 LS A679, LY A679, LG A679 - Hyper Micro SIDELED® LS Y876, LA Y876, LO Y876, LY Y876 LT Y87S - SmartLED LW L88C, LW L88S LB L89C, LB L89S, LG L890 LS L89K, LO L89K, LY L89K LS L896, LA L896, LO L896, LY L896 - TOPLED LS T670, LO T670, LY T670, LG T670, LP T670 LSG T670, LSP T670, LSY T670, LOP T670, LYG T670 LG T671, LOG T671, LSG T671 LB T673, LV T673, LT T673, LW T673 LH T674 LS T676, LA T676, LO T676, LY T676, LB T676, LH T676, LSB T676, LW T676 LB T67C, LV T67C, LT T67C, LS T67K, LO T67K, LY T67K, LW E67C LS E67B, LA E67B, LO E67B, LY E67B, LB E67C, LV E67C, LT E67C LW T67C LS T679, LY T679, LG T679 LS T770, LO T770, LY T770, LG T770, LP T770 LB T773, LV T773, LT T773, LW T773 LH T774 LS E675, LA E675, LY E675, LS T675 LS T776, LA T776, LO T776, LY T776, LB T776 LHGB T686 LT T68C, LB T68C - Hyper Mini TOPLED® LB M676 - Mini TOPLED Santana® LG M470 LS M47K, LO M47K, LY M47K Source: http://www.osram.convergy.de LUXEON: - LUMILED® LXK2-PW12-R00, LXK2-PW12-S00, LXK2-PW14-U00, LXK2-PW14-V00 LXK2-PM12-R00, LXK2-PM12-S00, LXK2-PM14-U00 LXK2-PE12-Q00, LXK2-PE12-R00, LXK2-PE12-S00, LXK2-PE14-T00, LXK2-PE14-U00 LXK2-PB12-K00, LXK2-PB12-L00, LXK2-PB12-M00, LXK2-PB14-N00, LXK2-PB14-P00, LXK2-PB14-Q00 LXK2-PR12-L00, LXK2-PR12-M00, LXK2-PR14-Q00, LXK2-PR14-R00 LXK2-PD12-Q00, LXK2-PD12-R00, LXK2-PD12-S00 LXK2-PH12-R00, LXK2-PH12-S00 LXK2-PL12-P00, LXK2-PL12-Q00, LXK2-PL12-R00 Source: www.luxeon.com KINGBRIGHT: KA-3528ASYC Source: www.kingbright.com; DIGIKEY#: 1080-1405-1-ND
MOUT0 MOUT1-MOUT3 = SAUVE:MINI_FIT_JR_5569
OUTPUTINDUCTOR = ian:SUMIDA_INDUCTOR; DIGIKEY: 308-1333-1-ND
P-FET1-P-FET4 = SAUVE:MOSFET_P-CHANNEL; DIGIKEY: SI7135DP-T1-GE3CT-ND
Q1-Q4 Q8-Q20 = SparkFun-DiscreteSemi:MOSFET-NCHANNEL: Common NMOSFET Parts MFG P/N Store ID Prod ID FDD8780 TRANS-09984 SI7820DN TRANS-11055 FDS6630A IC-08089 2N7002PW TRANS-11151 FQP30N06L COM-10213 TRANS-10060 BSS123LT1G TRANS-08345 BSS138 TRANS-00830 BS170 2N7000; DIGIKEY: BSS138KCT-ND; PROD_ID: TRANS-00830
Q5 Q6 = crystal:CRYSTAL: CRYSTAL; OC_FARNELL: unknown; OC_NEWARK: unknown
Q7 = Jon_LIB:CRYSTAL_16MHZ; DIGIKEY#: XC1137CT-ND
R4-R8 R10 R14 R22-R38 R41-R43 R45 R46 R49 = SparkFun:RESISTOR: Resistor Basic schematic elements and footprints for 0603, 1206, and PTH resistors.; DIGIKEY: RMCF0603JT10K0CT-ND
R17 = Jon_LIB:R-US: RESISTOR, American symbol; DIGIKEY#: P10.0KHCT-ND
R39 = Jon_LIB:R-US: RESISTOR, American symbol; DIGIKEY#: P10KDBCT-ND
R40 = Jon_LIB:R-US: RESISTOR, American symbol; DIGIKEY#: P432DBCT-ND
R44 R47 R48 = Jon_LIB:R-US: RESISTOR, American symbol; DIGIKEY#: P750CCT-ND
S1 S2 = MAAV:SWITCH-OFF-MOM
SV1 = MAAV:AVRISP-6: PIN HEADER
SV5 = Jon_LIB:MA03-1: PIN HEADER; DIGIKEY#: 3M9477-ND; OC_FARNELL: unknown; OC_NEWARK: unknown
U1 = MAAV:ATMEGA328-AU; DIGIKEY: ATMEGA328-AU-ND; DIGIKEY#: ATMEGA328-AU-ND
U2 = MAAV:REG_3V_8SOIC; DIGIKEY: 296-2719-5-ND
U$1 = ian:TPS5450
U$2 = MAAV:JTAG-ARM
U$3 = ti-tiva:TM4C123GH6PM
U$4 = MAAV_13v1:JON_LIB_SWITCH_DPDT; DIGIKEY#: AS22AV-ND
U$5 = MAAV:POWER-MODULE-TI-6A; ANOTHER_DIGIKEY#: ED90452-ND; DIGIKEY#: 296-20515-ND
V_BATT V_BATT1 = MAAV:BATT-CONN-50A; DIGIKEY: WM1942-ND